# Altium schematic sheet MotorDriver.SchDoc
size A4; SheetNumber: 3; SheetTotal: 4
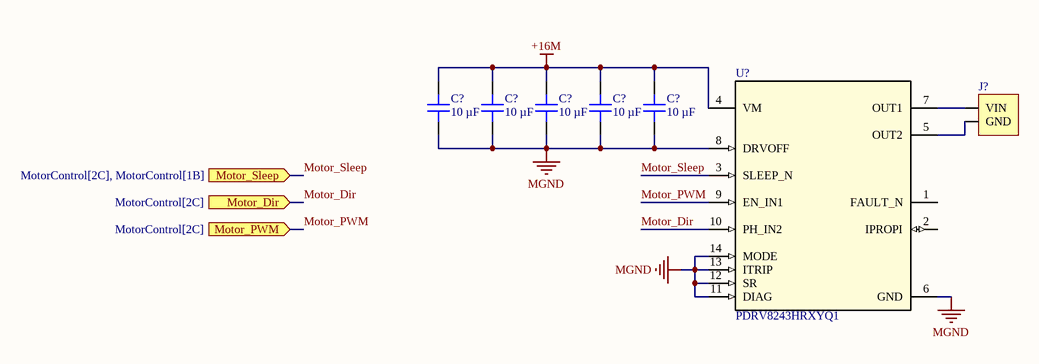
[diagram p0: MotorDriver.SchDoc]

## Parts
(Parts that share a designator on the sheet are numbered #1, #2 ... from top to bottom, then left to right.)
C?#1  10 µF  [CAP 1206_3216 - 0.8MM]
C?#2  10 µF  [CAP 1206_3216 - 0.8MM]
C?#3  10 µF  [CAP 1206_3216 - 0.8MM]
C?#4  10 µF  [CAP 1206_3216 - 0.8MM]
C?#5  10 µF  [CAP 1206_3216 - 0.8MM]
J?  Power Solder Pads  [New footprint 1]  (value not drawn)
U?  PDRV8243HRXYQ1  [RXY0014A-MFG]

## Ports
Motor_Dir (in, see MotorControl[2C]), Motor_PWM (in, see MotorControl[2C]), Motor_Sleep (in, see MotorControl[2C], MotorControl[1B])

## Nets
+16M: C?#1.2 C?#2.2 C?#3.2 C?#4.2 C?#5.2 U?.4(VM)
MGND: C?#1.1 C?#2.1 C?#3.1 C?#4.1 C?#5.1 U?.6(GND) U?.8(DRVOFF) U?.11(DIAG) U?.12(SR) U?.13(ITRIP) U?.14(MODE)
Motor_Dir: U?.10(PH_IN2) ; port Motor_Dir
Motor_PWM: U?.9(EN_IN1) ; port Motor_PWM
Motor_Sleep: U?.3(SLEEP_N) ; port Motor_Sleep
NetJ?_1: J?.1(GND) U?.5(OUT2)
NetJ?_2: J?.2(VIN) U?.7(OUT1)

Not connected (* = marked no-connect by the designer): U? 1(FAULT_N) 2(IPROPI)

## Library data of the parts
C?#1-C?#5 = CC1206MRY5V9BB104: CAP CER 0.1UF 50V Y5V 1206; manufacturer: Yageo; Temperature Coefficient: Y5V (F); Tolerance: ±20%; Part Number: CC1206MRY5V9BB104; Value: 10 µF; Applications: General Purpose; Capacitance: 10 µF; componentlink1description: Datasheet; componentlink1url: http://www.yageo.com/documents/recent/UPY-GPHC_Y5V_6.3V-to-50V_8.pdf; componentlink2description: DigiKey Link; componentlink2url: https://www.digikey.com/en/products/detail/yageo/CC1206MRY5V9BB104/5884674; Device Package: 1206 (3216 Metric); lastupdated: 19.09.2022 13:06:48; Lifecycle Status: Active; Minimum Order: 1; Mounting Type: Surface Mount, MLCC; Operating Temperature: -30°C ~ 85°C; Package / Case: 1206 (3216 Metric); packaging: TapeAndReel; partid: 18711; Part Status: Active; price: 0.05; series: CC; Size / Dimension: 0.126" L x 0.063" W (3.20mm x 1.60mm); Supplier 1: DigiKey; Supplier Part Number 1: 311-4504-1-ND; Thickness (Max): 0.028" (0.70mm); Voltage - Rated: 50V
J? = CMP-00000-5
U? = PDRV8243HRXYQ1: No Description Available; Mfr_Name: Texas Instruments; Type: DEV; RefDes: RefDes; Copyright: Copyright (C) 2022 Ultra Librarian. All rights reserved.; Manufacturer_Part_Number: PDRV8243HRXYQ1